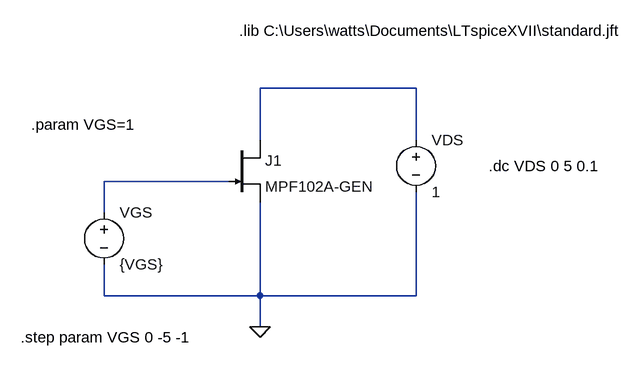
[diagram p0: schematic njfet_mpf102a.asc]
njfet_mpf102a.asc, the LTspice schematic file:
Version 4
SHEET 1 1024 680
WIRE 432 -16 192 -16
WIRE 192 64 192 -16
WIRE 432 64 432 -16
WIRE 144 128 -48 128
WIRE -48 176 -48 128
WIRE -48 304 -48 256
WIRE 192 304 192 160
WIRE 192 304 -48 304
WIRE 432 304 432 144
WIRE 432 304 192 304
WIRE 192 352 192 304
FLAG 192 352 0
SYMBOL voltage -48 160 R0
SYMATTR InstName VGS
SYMATTR Value {VGS}
SYMBOL voltage 432 48 R0
SYMATTR InstName VDS
SYMATTR Value 1
SYMBOL njf 144 64 R0
SYMATTR InstName J1
SYMATTR Value MPF102A-GEN
TEXT 160 -104 Left 2 !.lib C:\\Users\\watts\\Documents\\LTspiceXVII\\standard.jft
TEXT 544 104 Left 2 !.dc VDS 0 5 0.1
TEXT -160 40 Left 2 !.param VGS=1
TEXT -176 368 Left 2 !.step param VGS 0 -5 -1

The netlist it stands for:
* njfet_mpf102a.asc
VGS N002 0 {VGS}
VDS N001 0 1
J1 N001 N002 0 MPF102A-GEN
.model NJF NJF
.model PJF PJF
.lib standard.jft
.lib C:\Users\watts\Documents\LTspiceXVII\standard.jft
.dc VDS 0 5 0.1
.param VGS=1
.step param VGS 0 -5 -1
.backanno
.end